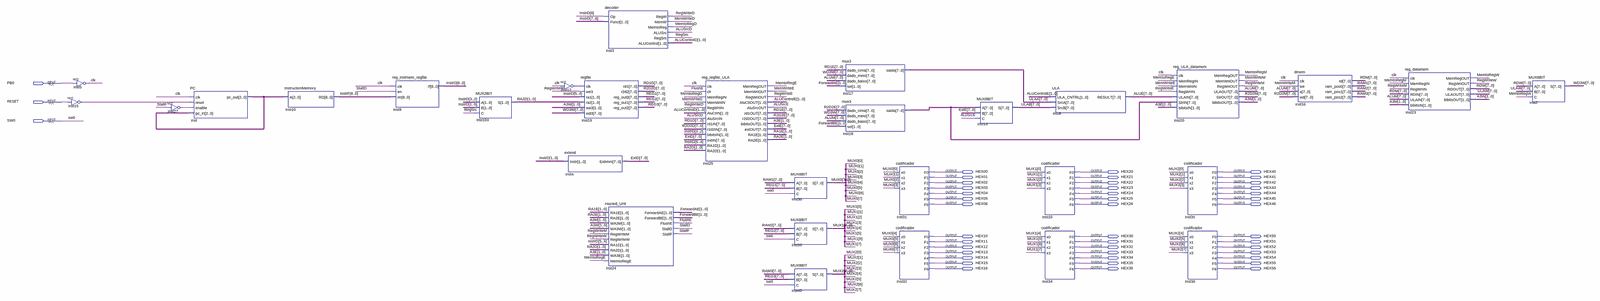
[diagram p0: schematic sheet, whole]
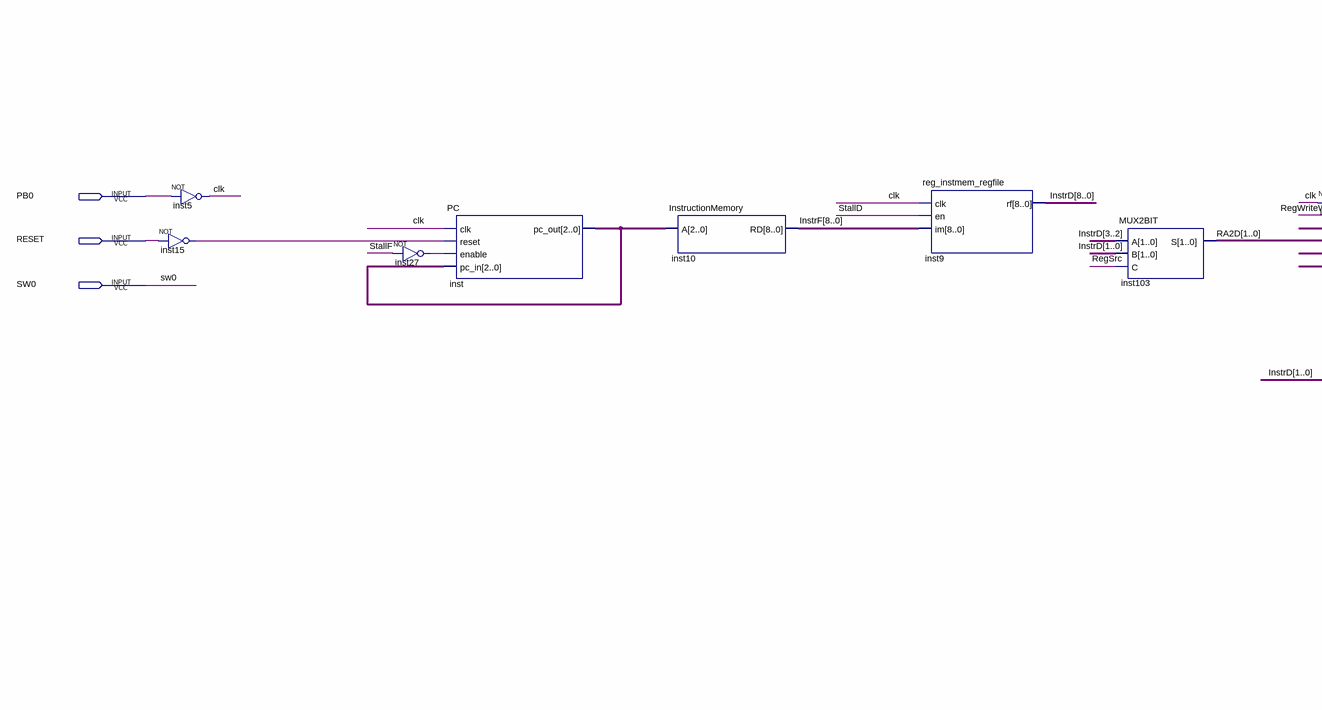
[diagram p1: schematic sheet, left part]
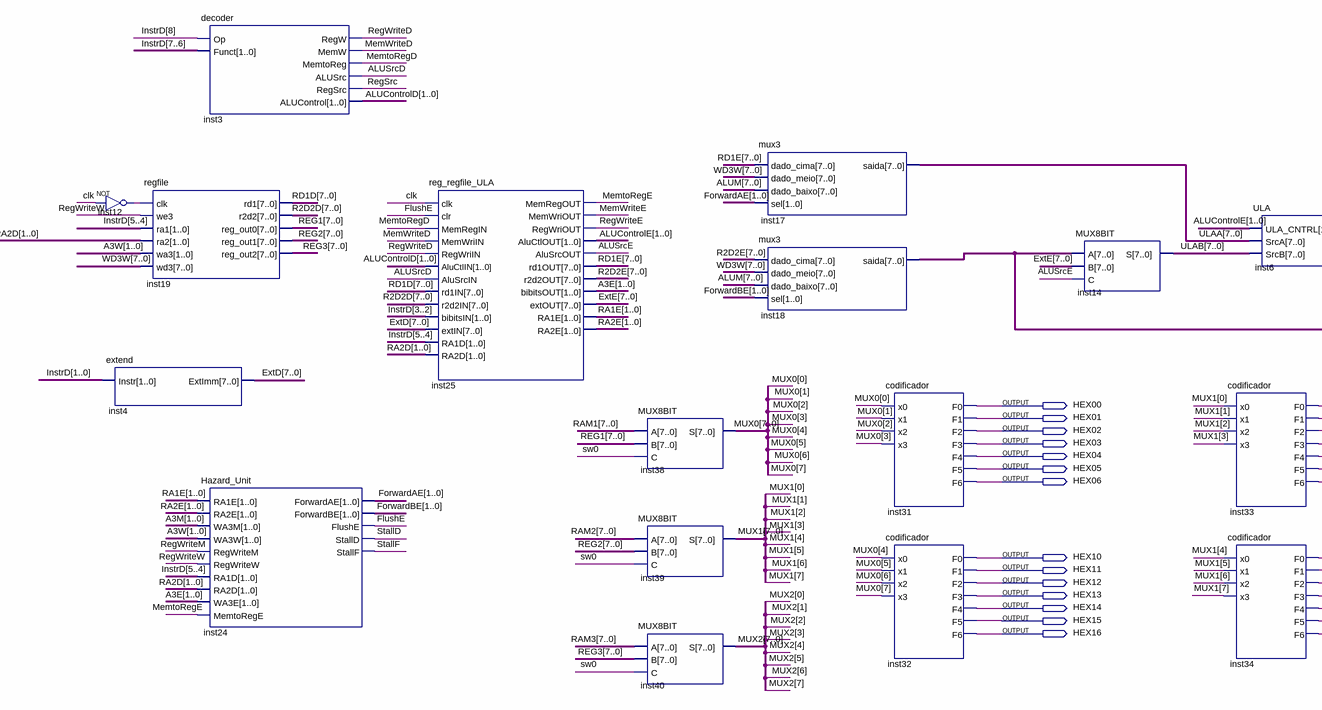
[diagram p2: schematic sheet, centre part]
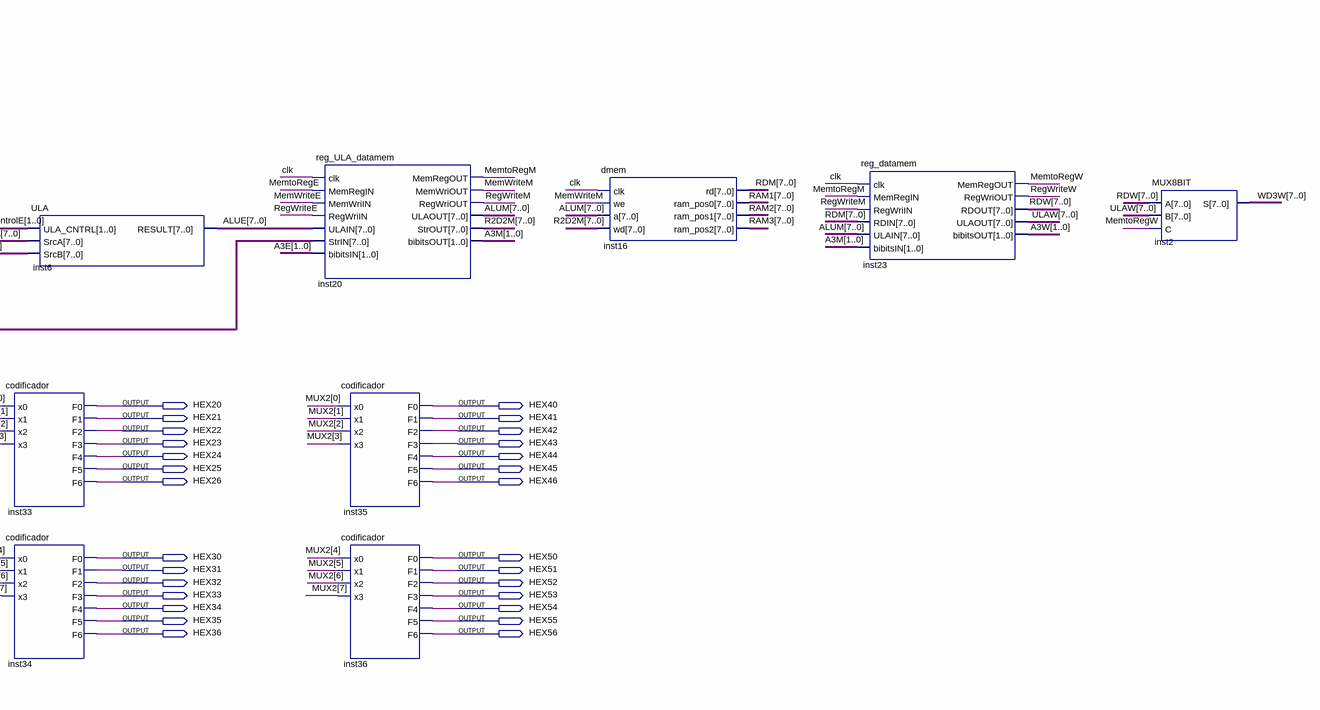
[diagram p3: schematic sheet, right part]
// Quartus schematic Processador8bits.bdf as structural Verilog: 30 symbols, 45 pins
module Processador8bits (
  input  PB0,
  input  RESET,
  input  SW0,
  output HEX00,
  output HEX20,
  output HEX40,
  output HEX01,
  output HEX21,
  output HEX41,
  output HEX02,
  output HEX22,
  output HEX42,
  output HEX03,
  output HEX23,
  output HEX43,
  output HEX04,
  output HEX24,
  output HEX44,
  output HEX05,
  output HEX25,
  output HEX45,
  output HEX06,
  output HEX26,
  output HEX46,
  output HEX10,
  output HEX30,
  output HEX50,
  output HEX11,
  output HEX31,
  output HEX51,
  output HEX12,
  output HEX32,
  output HEX52,
  output HEX13,
  output HEX33,
  output HEX53,
  output HEX14,
  output HEX34,
  output HEX54,
  output HEX15,
  output HEX35,
  output HEX55,
  output HEX16,
  output HEX36,
  output HEX56
);

  wire ALUSrcD, ALUSrcE, clk, FlushE, inst12_out, inst15_out, inst27_out, MemtoRegD, MemtoRegE, MemtoRegM,
       MemtoRegW, MemWriteD, MemWriteE, MemWriteM, RegSrc, RegWriteD, RegWriteE, RegWriteM, RegWriteW,
       StallD, StallF;
  wire [1:0] A3E, A3M, A3W, ALUControlD, ALUControlE, ForwardAE, ForwardBE, RA1E, RA2D, RA2E;
  wire [2:0] inst_pc_out;
  wire [7:0] ALUE, ALUM, ExtD, ExtE, inst18_saida, MUX0, MUX1, MUX2, R2D2D, R2D2E, R2D2M, RAM1, RAM2, RAM3,
       RD1D, RD1E, RDM, RDW, REG1, REG2, REG3, ULAA, ULAB, ULAW, WD3W;
  wire [8:0] InstrD, InstrF;

  not inst5 (clk, PB0);
  not inst15 (inst15_out, RESET);
  not inst27 (inst27_out, StallF);
  PC inst (.clk(clk), .reset(inst15_out), .enable(inst27_out), .pc_in(inst_pc_out), .pc_out(inst_pc_out));
  InstructionMemory inst10 (.A(inst_pc_out), .RD(InstrF));
  reg_instmem_regfile inst9 (.clk(clk), .en(StallD), .im(InstrF), .rf(InstrD));
  MUX2BIT inst103 (.A(InstrD[3:2]), .B(InstrD[1:0]), .C(RegSrc), .S(RA2D));
  not inst12 (inst12_out, clk);
  extend inst4 (.Instr(InstrD[1:0]), .ExtImm(ExtD));
  regfile inst19 (
    .clk(inst12_out), .we3(RegWriteW), .ra1(InstrD[5:4]), .ra2(RA2D), .wa3(A3W), .wd3(WD3W), .rd1(RD1D),
    .r2d2(R2D2D), .reg_out0(REG1), .reg_out1(REG2), .reg_out2(REG3));
  decoder inst3 (
    .Op(InstrD[8]), .Funct(InstrD[7:6]), .RegW(RegWriteD), .MemW(MemWriteD), .MemtoReg(MemtoRegD),
    .ALUSrc(ALUSrcD), .RegSrc(RegSrc), .ALUControl(ALUControlD));
  Hazard_Unit inst24 (
    .RA1E(RA1E), .RA2E(RA2E), .WA3M(A3M), .WA3W(A3W), .RegWriteM(RegWriteM), .RegWriteW(RegWriteW),
    .RA1D(InstrD[5:4]), .RA2D(RA2D), .WA3E(A3E), .MemtoRegE(MemtoRegE), .ForwardAE(ForwardAE),
    .ForwardBE(ForwardBE), .FlushE(FlushE), .StallD(StallD), .StallF(StallF));
  reg_regfile_ULA inst25 (
    .clk(clk), .clr(FlushE), .MemRegIN(MemtoRegD), .MemWriIN(MemWriteD), .RegWriIN(RegWriteD),
    .AluCtlIN(ALUControlD), .AluSrcIN(ALUSrcD), .rd1IN(RD1D), .r2d2IN(R2D2D), .bibitsIN(InstrD[3:2]),
    .extIN(ExtD), .RA1D(InstrD[5:4]), .RA2D(RA2D), .MemRegOUT(MemtoRegE), .MemWriOUT(MemWriteE),
    .RegWriOUT(RegWriteE), .AluCtlOUT(ALUControlE), .AluSrcOUT(ALUSrcE), .rd1OUT(RD1E), .r2d2OUT(R2D2E),
    .bibitsOUT(A3E), .extOUT(ExtE), .RA1E(RA1E), .RA2E(RA2E));
  MUX8BIT inst38 (.A(RAM1), .B(REG1), .C(SW0), .S(MUX0));
  MUX8BIT inst39 (.A(RAM2), .B(REG2), .C(SW0), .S(MUX1));
  MUX8BIT inst40 (.A(RAM3), .B(REG3), .C(SW0), .S(MUX2));
  mux3 inst17 (.dado_cima(RD1E), .dado_meio(WD3W), .dado_baixo(ALUM), .sel(ForwardAE), .saida(ULAA));
  mux3 inst18 (.dado_cima(R2D2E), .dado_meio(WD3W), .dado_baixo(ALUM), .sel(ForwardBE), .saida(inst18_saida));
  codificador inst31 (
    .x0(MUX0[0]), .x1(MUX0[1]), .x2(MUX0[2]), .x3(MUX0[3]), .F0(HEX00), .F1(HEX01), .F2(HEX02), .F3(HEX03),
    .F4(HEX04), .F5(HEX05), .F6(HEX06));
  codificador inst32 (
    .x0(MUX0[4]), .x1(MUX0[5]), .x2(MUX0[6]), .x3(MUX0[7]), .F0(HEX10), .F1(HEX11), .F2(HEX12), .F3(HEX13),
    .F4(HEX14), .F5(HEX15), .F6(HEX16));
  MUX8BIT inst14 (.A(inst18_saida), .B(ExtE), .C(ALUSrcE), .S(ULAB));
  codificador inst33 (
    .x0(MUX1[0]), .x1(MUX1[1]), .x2(MUX1[2]), .x3(MUX1[3]), .F0(HEX20), .F1(HEX21), .F2(HEX22), .F3(HEX23),
    .F4(HEX24), .F5(HEX25), .F6(HEX26));
  codificador inst34 (
    .x0(MUX1[4]), .x1(MUX1[5]), .x2(MUX1[6]), .x3(MUX1[7]), .F0(HEX30), .F1(HEX31), .F2(HEX32), .F3(HEX33),
    .F4(HEX34), .F5(HEX35), .F6(HEX36));
  ULA inst6 (.ULA_CNTRL(ALUControlE), .SrcA(ULAA), .SrcB(ULAB), .RESULT(ALUE));
  reg_ULA_datamem inst20 (
    .clk(clk), .MemRegIN(MemtoRegE), .MemWriIN(MemWriteE), .RegWriIN(RegWriteE), .ULAIN(ALUE),
    .StrIN(inst18_saida), .bibitsIN(A3E), .MemRegOUT(MemtoRegM), .MemWriOUT(MemWriteM),
    .RegWriOUT(RegWriteM), .ULAOUT(ALUM), .StrOUT(R2D2M), .bibitsOUT(A3M));
  codificador inst35 (
    .x0(MUX2[0]), .x1(MUX2[1]), .x2(MUX2[2]), .x3(MUX2[3]), .F0(HEX40), .F1(HEX41), .F2(HEX42), .F3(HEX43),
    .F4(HEX44), .F5(HEX45), .F6(HEX46));
  codificador inst36 (
    .x0(MUX2[4]), .x1(MUX2[5]), .x2(MUX2[6]), .x3(MUX2[7]), .F0(HEX50), .F1(HEX51), .F2(HEX52), .F3(HEX53),
    .F4(HEX54), .F5(HEX55), .F6(HEX56));
  dmem inst16 (
    .clk(clk), .we(MemWriteM), .a(ALUM), .wd(R2D2M), .rd(RDM), .ram_pos0(RAM1), .ram_pos1(RAM2),
    .ram_pos2(RAM3));
  reg_datamem inst23 (
    .clk(clk), .MemRegIN(MemtoRegM), .RegWriIN(RegWriteM), .RDIN(RDM), .ULAIN(ALUM), .bibitsIN(A3M),
    .MemRegOUT(MemtoRegW), .RegWriOUT(RegWriteW), .RDOUT(RDW), .ULAOUT(ULAW), .bibitsOUT(A3W));
  MUX8BIT inst2 (.A(RDW), .B(ULAW), .C(MemtoRegW), .S(WD3W));
endmodule
